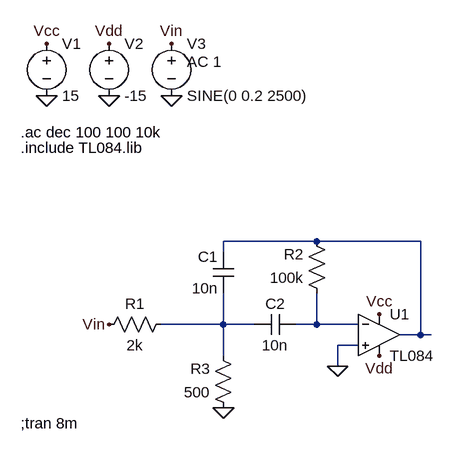
[diagram p0: schematic Passe Bande.asc]
Passe Bande.asc, the LTspice schematic file:
Version 4
SHEET 1 880 680
WIRE 336 16 192 16
WIRE 496 16 336 16
WIRE 192 32 192 16
WIRE 192 144 192 96
WIRE 192 144 96 144
WIRE 240 144 192 144
WIRE 336 144 336 96
WIRE 336 144 304 144
WIRE 400 144 336 144
WIRE 496 160 496 16
WIRE 496 160 464 160
WIRE 512 160 496 160
WIRE 400 176 368 176
WIRE 192 192 192 144
WIRE 368 208 368 176
FLAG 368 208 0
FLAG 432 128 Vcc
FLAG 432 192 Vdd
FLAG -80 -208 0
FLAG 16 -208 0
FLAG 112 -208 0
FLAG -80 -288 Vcc
FLAG 16 -288 Vdd
FLAG 112 -288 Vin
FLAG 192 272 0
FLAG 16 144 Vin
SYMBOL res 112 128 R90
WINDOW 0 0 56 VBottom 2
WINDOW 3 32 56 VTop 2
SYMATTR InstName R1
SYMATTR Value 2k
SYMBOL res 352 112 R180
WINDOW 0 36 76 Left 2
WINDOW 3 36 40 Left 2
SYMATTR InstName R2
SYMATTR Value 100k
SYMBOL res 208 288 R180
WINDOW 0 36 76 Left 2
WINDOW 3 36 40 Left 2
SYMATTR InstName R3
SYMATTR Value 500
SYMBOL cap 304 128 R90
WINDOW 0 0 32 VBottom 2
WINDOW 3 32 32 VTop 2
SYMATTR InstName C2
SYMATTR Value 10n
SYMBOL cap 208 96 R180
WINDOW 0 24 56 Left 2
WINDOW 3 24 8 Left 2
SYMATTR InstName C1
SYMATTR Value 10n
SYMBOL Opamps\\opamp2 432 96 R0
SYMATTR InstName U1
SYMATTR Value TL084
SYMBOL voltage -80 -304 R0
WINDOW 123 0 0 Left 0
WINDOW 39 0 0 Left 0
SYMATTR InstName V1
SYMATTR Value 15
SYMBOL voltage 16 -304 R0
WINDOW 123 0 0 Left 0
WINDOW 39 0 0 Left 0
SYMATTR InstName V2
SYMATTR Value -15
SYMBOL voltage 112 -304 R0
WINDOW 123 24 44 Left 2
WINDOW 39 0 0 Left 0
SYMATTR Value2 AC 1
SYMATTR InstName V3
SYMATTR Value SINE(0 0.2 2500)
TEXT -120 -152 Left 2 !.ac dec 100 100 10k
TEXT -120 -128 Left 2 !.include TL084.lib
TEXT -120 296 Left 2 !;tran 8m

The netlist it stands for:
* Passe Bande.asc
R1 N002 Vin 2k
R2 N003 N001 100k
R3 0 N002 500
C2 N003 N002 10n
C1 N002 N001 10n
XU1 0 N003 Vcc Vdd N001 TL084  ; pins In+ In- V+ V- OUT
V1 Vcc 0 15
V2 Vdd 0 -15
V3 Vin 0 SINE(0 0.2 2500) AC 1
.ac dec 100 100 10k
.include TL084.lib
;tran 8m
.backanno
.end